# EAGLE design auxDaqUnitTopAnalog2022 (EAGLE 9.6.2)
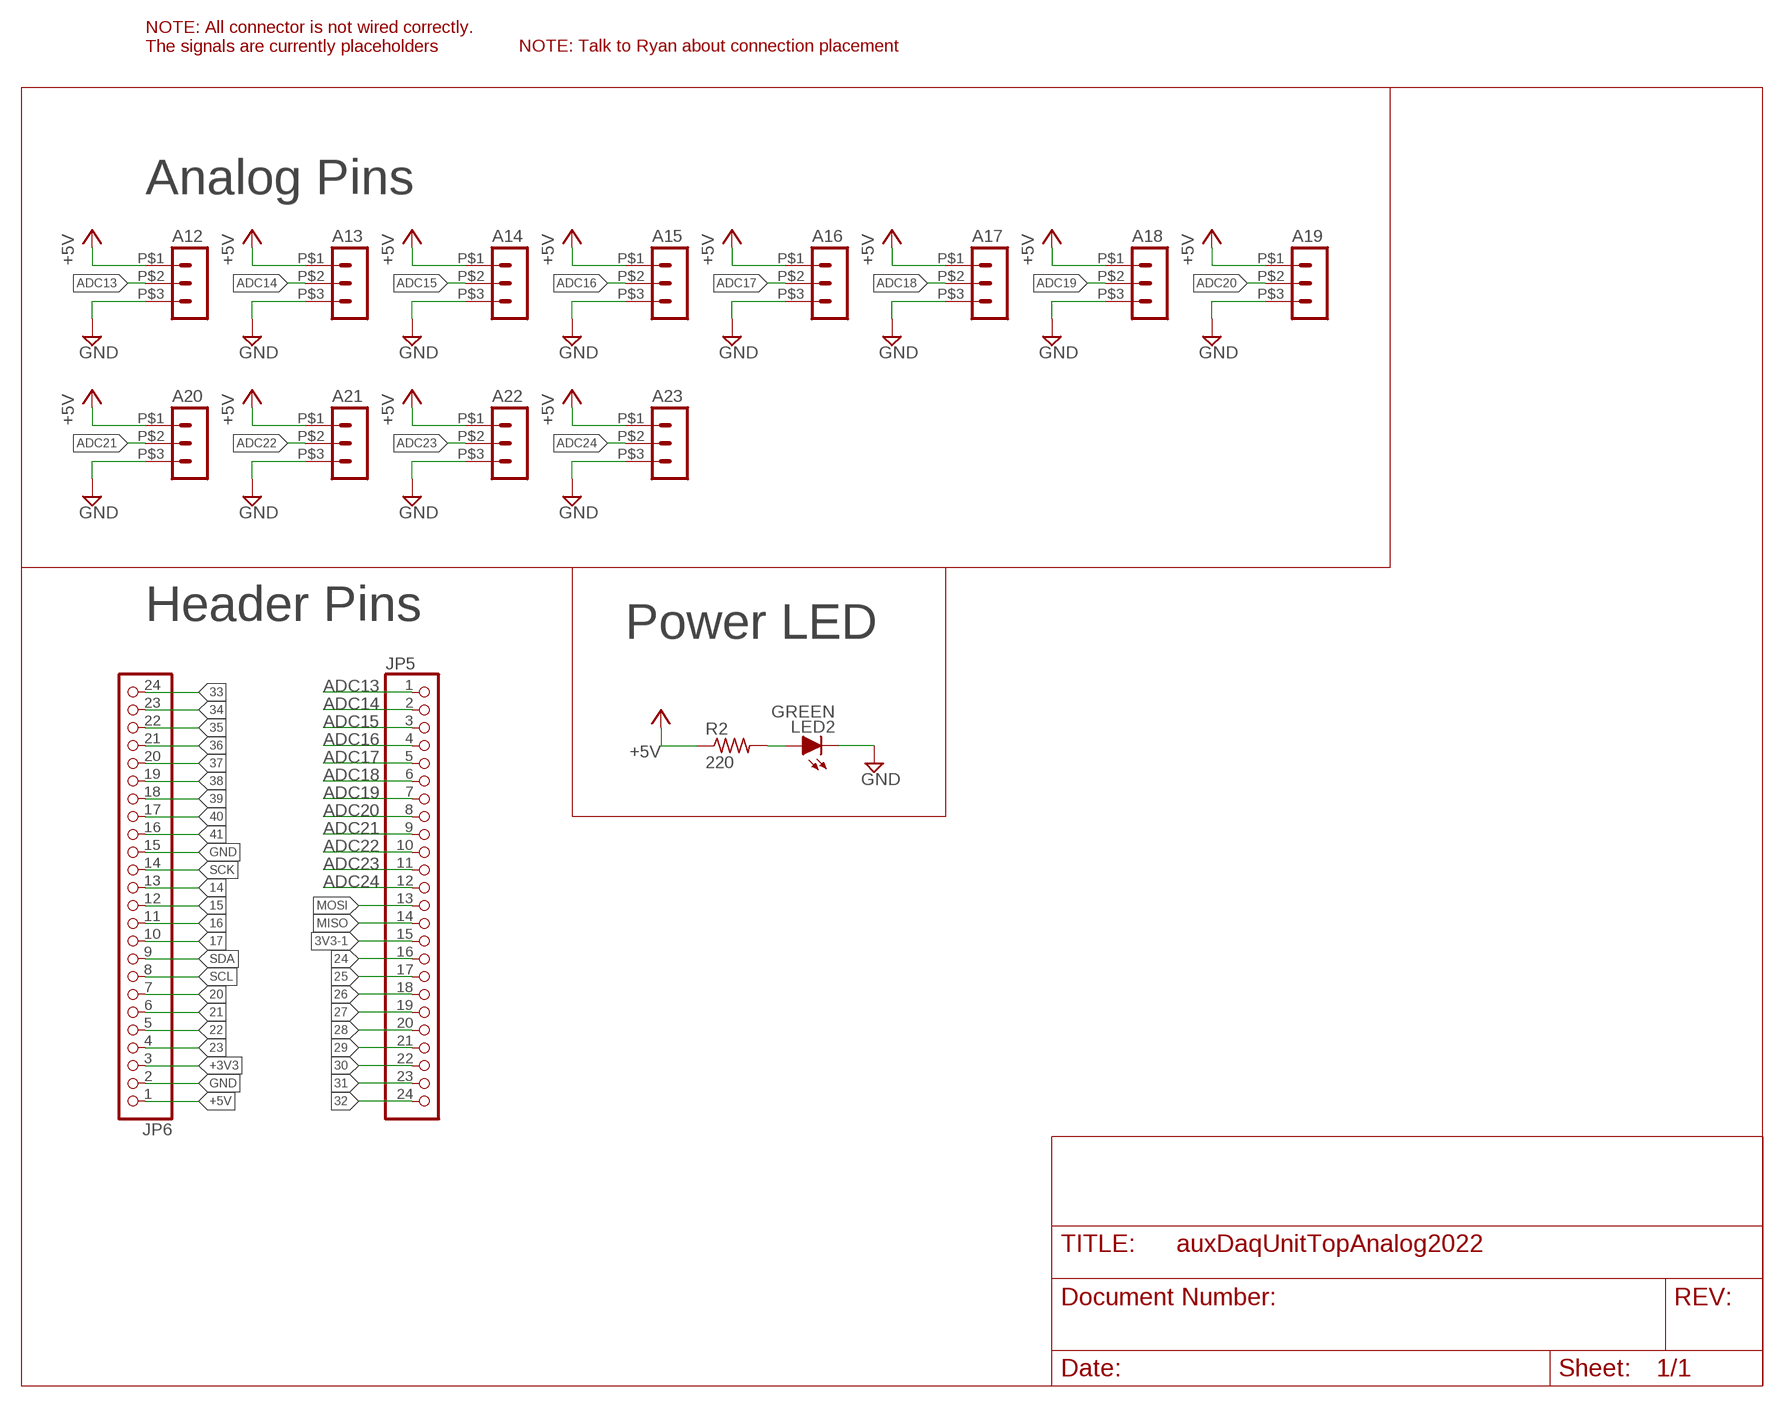
[diagram p0: schematic, sheet 1]
FRAME1 (LETTER_L): NAMEYEAR: PETER2022

## Parts
A12  HEADER_POS3_43650-0300  [43650-0300]
A13  HEADER_POS3_43650-0300  [43650-0300]
A14  HEADER_POS3_43650-0300  [43650-0300]
A15  HEADER_POS3_43650-0300  [43650-0300]
A16  HEADER_POS3_43650-0300  [43650-0300]
A17  HEADER_POS3_43650-0300  [43650-0300]
A18  HEADER_POS3_43650-0300  [43650-0300]
A19  HEADER_POS3_43650-0300  [43650-0300]
A20  HEADER_POS3_43650-0300  [43650-0300]
A21  HEADER_POS3_43650-0300  [43650-0300]
A22  HEADER_POS3_43650-0300  [43650-0300]
A23  HEADER_POS3_43650-0300  [43650-0300]
JP5  PINHD-1X24  [1X24]
JP6  PINHD-1X24  [1X24]
LED2  GREEN  LED-0603  [LED-603]
R2  220  RES_SMDR0603  [R0603]

## Nets
3V3-1: JP5.15
14: JP6.13
15: JP6.12
16: JP6.11
17: JP6.10
20: JP6.7
21: JP6.6
22: JP6.5
23: JP6.4
24: JP5.16
25: JP5.17
26: JP5.18
27: JP5.19
28: JP5.20
29: JP5.21
30: JP5.22
31: JP5.23
32: JP5.24
33: JP6.24
34: JP6.23
35: JP6.22
36: JP6.21
37: JP6.20
38: JP6.19
39: JP6.18
40: JP6.17
41: JP6.16
+3V3: JP6.3
+5V: A12.P$1 A13.P$1 A14.P$1 A15.P$1 A16.P$1 A17.P$1 A18.P$1 A19.P$1 A20.P$1 A21.P$1 A22.P$1 A23.P$1 JP6.1 R2.1
ADC13: A12.P$2 JP5.1
ADC14: A13.P$2 JP5.2
ADC15: A14.P$2 JP5.3
ADC16: A15.P$2 JP5.4
ADC17: A16.P$2 JP5.5
ADC18: A17.P$2 JP5.6
ADC19: A18.P$2 JP5.7
ADC20: A19.P$2 JP5.8
ADC21: A20.P$2 JP5.9
ADC22: A21.P$2 JP5.10
ADC23: A22.P$2 JP5.11
ADC24: A23.P$2 JP5.12
GND: A12.P$3 A13.P$3 A14.P$3 A15.P$3 A16.P$3 A17.P$3 A18.P$3 A19.P$3 A20.P$3 A21.P$3 A22.P$3 A23.P$3 JP6.2 JP6.15 LED2.C
MISO: JP5.14
MOSI: JP5.13
N$2: LED2.A R2.2
SCK: JP6.14
SCL: JP6.8
SDA: JP6.9

## Notes on the sheet
- NOTE: All connector is not wired correctly. 
  The signals are currently placeholders
- NOTE: Talk to Ryan about connection placement
- Analog Pins
- Header Pins
- Power LED

## Library data of the parts
A12-A23 = GTOR - Microfit Connector:HEADER_POS3_?: Molex - Micro-Fit 3.0 Series connector, 3.00mm (0.118") pitch header, 3 positions.
JP5 JP6 = GTOR - Connectors:PINHD-1X24: PIN HEADER
LED2 = GTOR - Passive Components:LED: Light Emitting Diode (LED) Source: Dangerous Prototypes Eagle Library <https://github.com/DangerousPrototypes/Eagle_Part_Library>
R2 = GTOR - Passive Components:RES_SMD: RESISTOR, American symbol; SPICEPREFIX: R

## Board
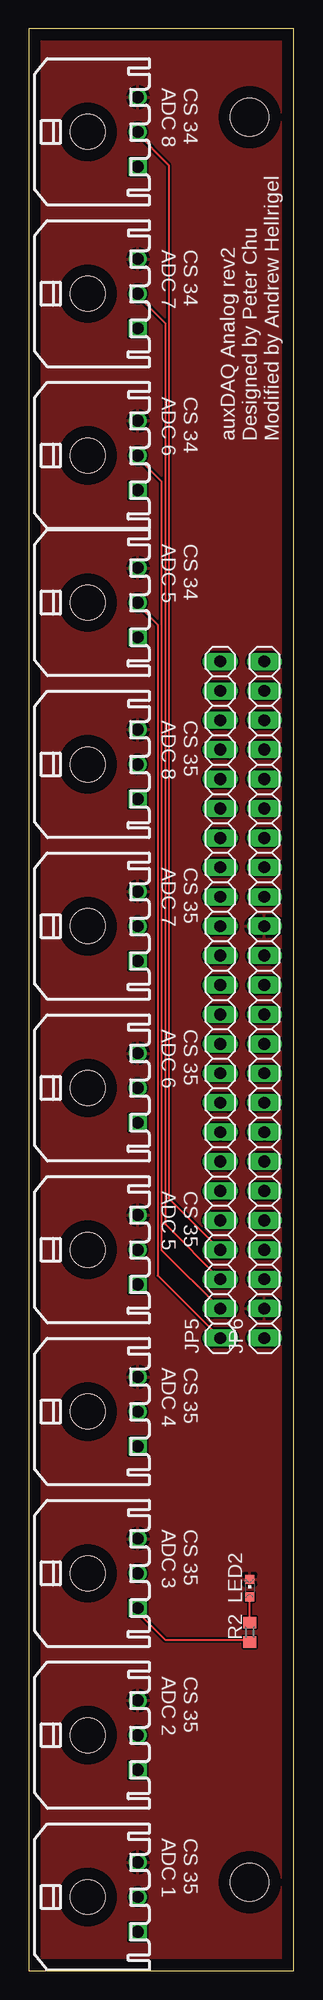
[diagram p1: board, top side]
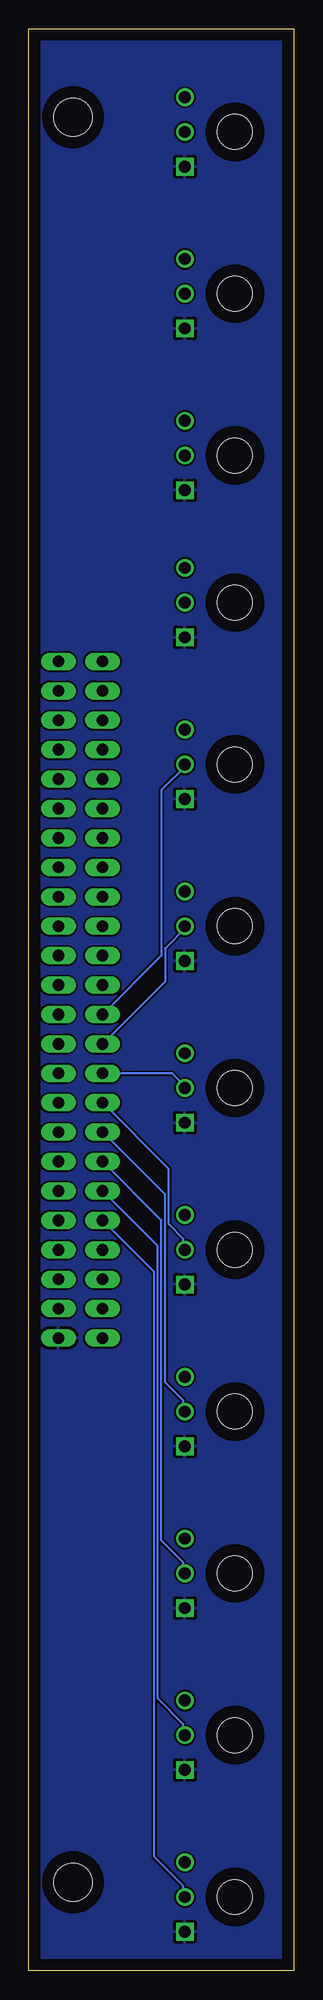
[diagram p2: board, bottom side, seen from below]

Size 22.86 x 167.64 mm. Coordinates in mm from the lower left corner, seen from the top.
Outline: 0,0 22.86,0 22.86,167.64 0,167.64 0,0
Copper layers (1*16): Top 0.035mm / dielectric 1.5mm / Bottom 0.035mm
Design rules "default": minimum track width 6mil, minimum drill 0.35mm, track to track 6mil, track to pad 6mil, pad to pad 6mil, via to via 6mil, smd to smd 6mil, copper to edge 40mil, drill to drill 6mil, minimum pad ring 10mil, minimum via ring 8mil, stop-mask expansion 4mil, vias tented up to drill 0mil, thermal gap 10mil
Holes 3.3 mm at 19.05,160.02 19.05,7.62

### Footprints (pad centres in the part's own frame; a part is rotated, then mirrored left to right if it is on the bottom)
43650-0300 = drill 1.02 square: P$1 3,4.32 | drill 1.02: P$2 0,4.32; P$3 -3,4.32 | hole 3: 0,0
1X24 = drill 1.016 long: 1 -29.21,0; 2 -26.67,0; 3 -24.13,0; 4 -21.59,0; 5 -19.05,0; 6 -16.51,0; 7 -13.97,0; 8 -11.43,0; 9 -8.89,0; 10 -6.35,0; 11 -3.81,0; 12 -1.27,0; 13 1.27,0; 14 3.81,0; 15 6.35,0; 16 8.89,0; 17 11.43,0; 18 13.97,0; 19 16.51,0; 20 19.05,0; 21 21.59,0; 22 24.13,0; 23 26.67,0; 24 29.21,0
LED-603 = smd 0.8 x 0.8: A 0,-0.75; C 0,0.75
R0603 = smd 1 x 1.1: 1 -0.85,0; 2 0.85,0

### Placement (x,y rotation side)
A12  5.08,118.11 270 top
A13  5.08,130.81 270 top
A14  5.08,144.78 270 top
A15  5.08,158.75 270 top
A16  5.08,6.35 270 top
A17  5.08,20.32 270 top
A18  5.08,34.29 270 top
A19  5.08,48.26 270 top
A20  5.08,62.23 270 top
A21  5.08,76.2 270 top
A22  5.08,90.17 270 top
A23  5.08,104.14 270 top
JP5  16.51,83.82 90 top
JP6  20.32,83.82 90 top
LED2  19.05,33.02 0 top
R2  19.05,29.21 90 top

### Tracks (layer width: path | path; a pad name or v marks a point on that pad's centre or on a via)
+5V
  Top 0.152: R2.1 19.05,28.57 11.75,28.57 9.21,31.11 A18.P$1
  pour Bottom: -11.43,167.64 -11.43,0 22.86,0 22.86,167.64
ADC13
  Top 0.152: JP5.1 11.11,60.01 11.11,116.2 9.21,118.11 A12.P$2
ADC14
  Top 0.152: JP5.2 11.43,62.23 11.43,128.59 9.21,130.81 A13.P$2
ADC15
  Top 0.152: JP5.3 11.75,64.45 11.75,142.24 9.21,144.78 A14.P$2
ADC16
  Top 0.152: JP5.4 12.07,66.67 12.07,155.89 9.21,158.75 A15.P$2
ADC17
  Bottom 0.152: JP5.5 12.07,60.33 12.07,9.84 9.52,7.3 9.52,6.35 A16.P$2
ADC18
  Bottom 0.152: JP5.6 11.75,62.55 11.75,23.5 9.52,21.27 9.52,20.32 A17.P$2
ADC19
  Bottom 0.152: JP5.7 11.43,64.77 11.43,37.15 9.52,35.24 9.52,34.29 A18.P$2
ADC20
  Bottom 0.152: JP5.8 11.11,66.99 11.11,50.8 9.52,49.21 9.52,48.26 A19.P$2
ADC21
  Bottom 0.152: JP5.9 10.8,69.22 10.8,64.45 9.52,63.18 9.52,62.23 A20.P$2
ADC22
  Bottom 0.152: JP5.10 10.48,77.47 9.21,76.2 A21.P$2
ADC23
  Bottom 0.152: JP5.11 11.11,85.41 11.11,88.27 9.21,90.17 A22.P$2
ADC24
  Bottom 0.152: JP5.12 11.43,87.63 11.43,101.92 9.21,104.14 A23.P$2
GND
  pour Top: -11.43,167.64 -11.43,0 22.86,0 22.86,167.64
N$2
  Top 0.152: R2.2 LED2.A

### Text on the board
tNames: CS 34 / ADC 8 | CS 34 / ADC 7 | CS 34 / ADC 6 | auxDAQ Analog rev2 / Designed by Peter Chu / Modified by Andrew Hellrigel | CS 34 / ADC 5 | CS 35 / ADC 8 | CS 35 / ADC 7 | CS 35 / ADC 6 | CS 35 / ADC 5 | CS 35 / ADC 4 | CS 35 / ADC 3 | CS 35 / ADC 2 | CS 35 / ADC 1